# Altium schematic sheet SIm_danglamlai.SchDoc
size A
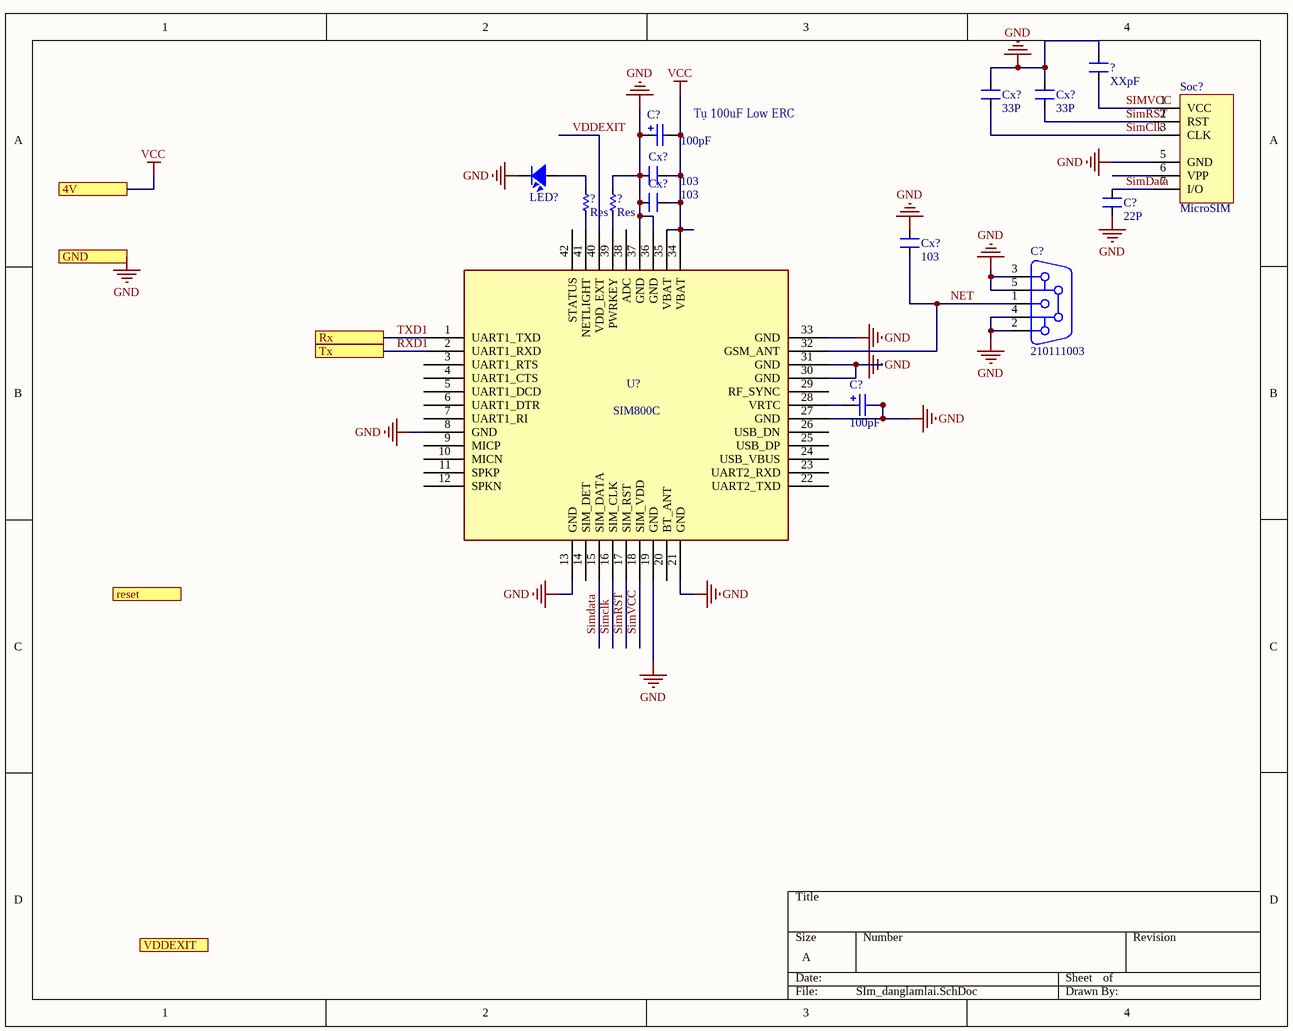
[diagram p0: SIm_danglamlai.SchDoc]

## Parts
(Parts that share a designator on the sheet are numbered #1, #2 ... from top to bottom, then left to right.)
?#1  XXpF  [CN-SMD-0805]
?#2  Res  [RES-SMD-1206]
?#3  Res  [RES-SMD-1206]
C?#1  value 100pF  [Cap_D]  (hidden comment: Cap_tan)
C?#2  22P  [CN-SMD-0805]
C?#3  210111003  [SMA-RA]
C?#4  value 100pF  [Cap_D]  (hidden comment: Cap_tan)
Cx?#1  33P  [CN-SMD-0805]
Cx?#2  33P  [CN-SMD-0805]
Cx?#3  103  [CN-SMD-1206]
Cx?#4  103  [CN-SMD-1206]
Cx?#5  103  [CN-SMD-1206]
LED?  LED  [LED 3512]  (value not drawn)
Soc?  MicroSIM  [microSIM]
U?  SIM800C  [SIM800C]

## Ports
4V, GND, reset, Rx, Tx, VDDEXIT

## Nets
GND: ?#1.2 ?#3.1 C?#1.1 C?#2.1 C?#3.2 C?#3.3 C?#3.4 C?#3.5 C?#4.2 Cx?#1.2 Cx?#2.2 Cx?#3.2 Cx?#4.2 Cx?#5.2 LED?.2 Soc?.5(GND) U?.8(GND) U?.13(GND) U?.19(GND) U?.21(GND) U?.27(GND) U?.30(GND) U?.31(GND) U?.33(GND) U?.36(GND) U?.37(GND) ; port GND
VCC: C?#1.2 Cx?#3.1 Cx?#4.1 U?.34(VBAT) U?.35(VBAT) ; port 4V
NET: C?#3.1 Cx?#5.1 U?.32(GSM_ANT)
RXD1: U?.2(UART1_RXD) ; port Tx
SimClk: Cx?#1.1 Soc?.3(CLK) U?.16(SIM_CLK)
SimData: C?#2.2 Soc?.7(I/O) U?.15(SIM_DATA)
SimRST: Cx?#2.1 Soc?.2(RST) U?.17(SIM_RST)
SIMVCC: ?#1.1 Soc?.1(VCC) U?.18(SIM_VDD)
TXD1: U?.1(UART1_TXD) ; port Rx
VDDEXIT: U?.40(VDD_EXT)
Net?#2_1: ?#2.1 LED?.1
Net?#2_2: ?#2.2 U?.41(NETLIGHT)
Net?#3_2: ?#3.2 U?.39(PWRKEY)
NetC?#4_1: C?#4.1 U?.28(VRTC)

Not connected (* = marked no-connect by the designer): Soc? 6(VPP); U? 3(UART1_RTS) 4(UART1_CTS) 5(UART1_DCD) 6(UART1_DTR) 7(UART1_RI) 9(MICP) 10(MICN) 11(SPKP) 12(SPKN) 14(SIM_DET) 20(BT_ANT) 22(UART2_TXD) 23(UART2_RXD) 24(USB_VBUS) 25(USB_DP) 26(USB_DN) 29(RF_SYNC) 38(ADC) 42(STATUS)

## Notes on the sheet
- (near C?#1) Tụ 100uF Low ERC

## Library data of the parts
?#1 C?#2 Cx?#1-Cx?#5 = CN: Value: 33pF
?#2 ?#3 = Res-SMD: Resistor; Manufacturer: Generic Components; Class: Passive; Published: 08/06/2000; Publisher: Altium Hobart Technology Centre
C?#1 C?#4 = Tantalum Cap: Solid Tantalum Chip Capacitor, Standard T491 Series - Industrial Grade; Published: 17-Jul-2002; LatestRevisionDate: 19-Mar-2004; LatestRevisionNote: Silkscreen dimensions re-sized.; DatasheetDocument: Mar-2001; PackageDocument: Mar-2001; PackageReference: B; Publisher: Altium Limited; Code_JEITA: 3528-21; ComponentLink1Description: Manufacturer Link; ComponentLink1URL: http://www.kemet.com/; ComponentLink2Description: Datasheet; ComponentLink2URL: http://www.kemet.com/kemet/web/homepage/kechome.nsf/vapubfilesname/F3102TA.pdf/$file/F3102TA.pdf
C?#3 = CON Ant: CONNECTOR ANTEN; Manufacturer: Würth Elektronik eiSos GmbH; partNo: 210111003; ComponentLink1Description: Manufacturer; ComponentLink1URL: http://www.we-online.de; Created by: Christin Zierenner; Created Date: May 2012; ComponentLink2Description: Datasheet; ComponentLink2URL: http://katalog.we-online.de/kataloge/eisos/index.php?language=en&pf=Filter_gerade
LED? = LED SMD: Value: LED 3 - 5 ly 2 Colour
Soc? = Soc_Micro_SIM